# Altium project DM3370.PrjPcb (part 1 of 14)
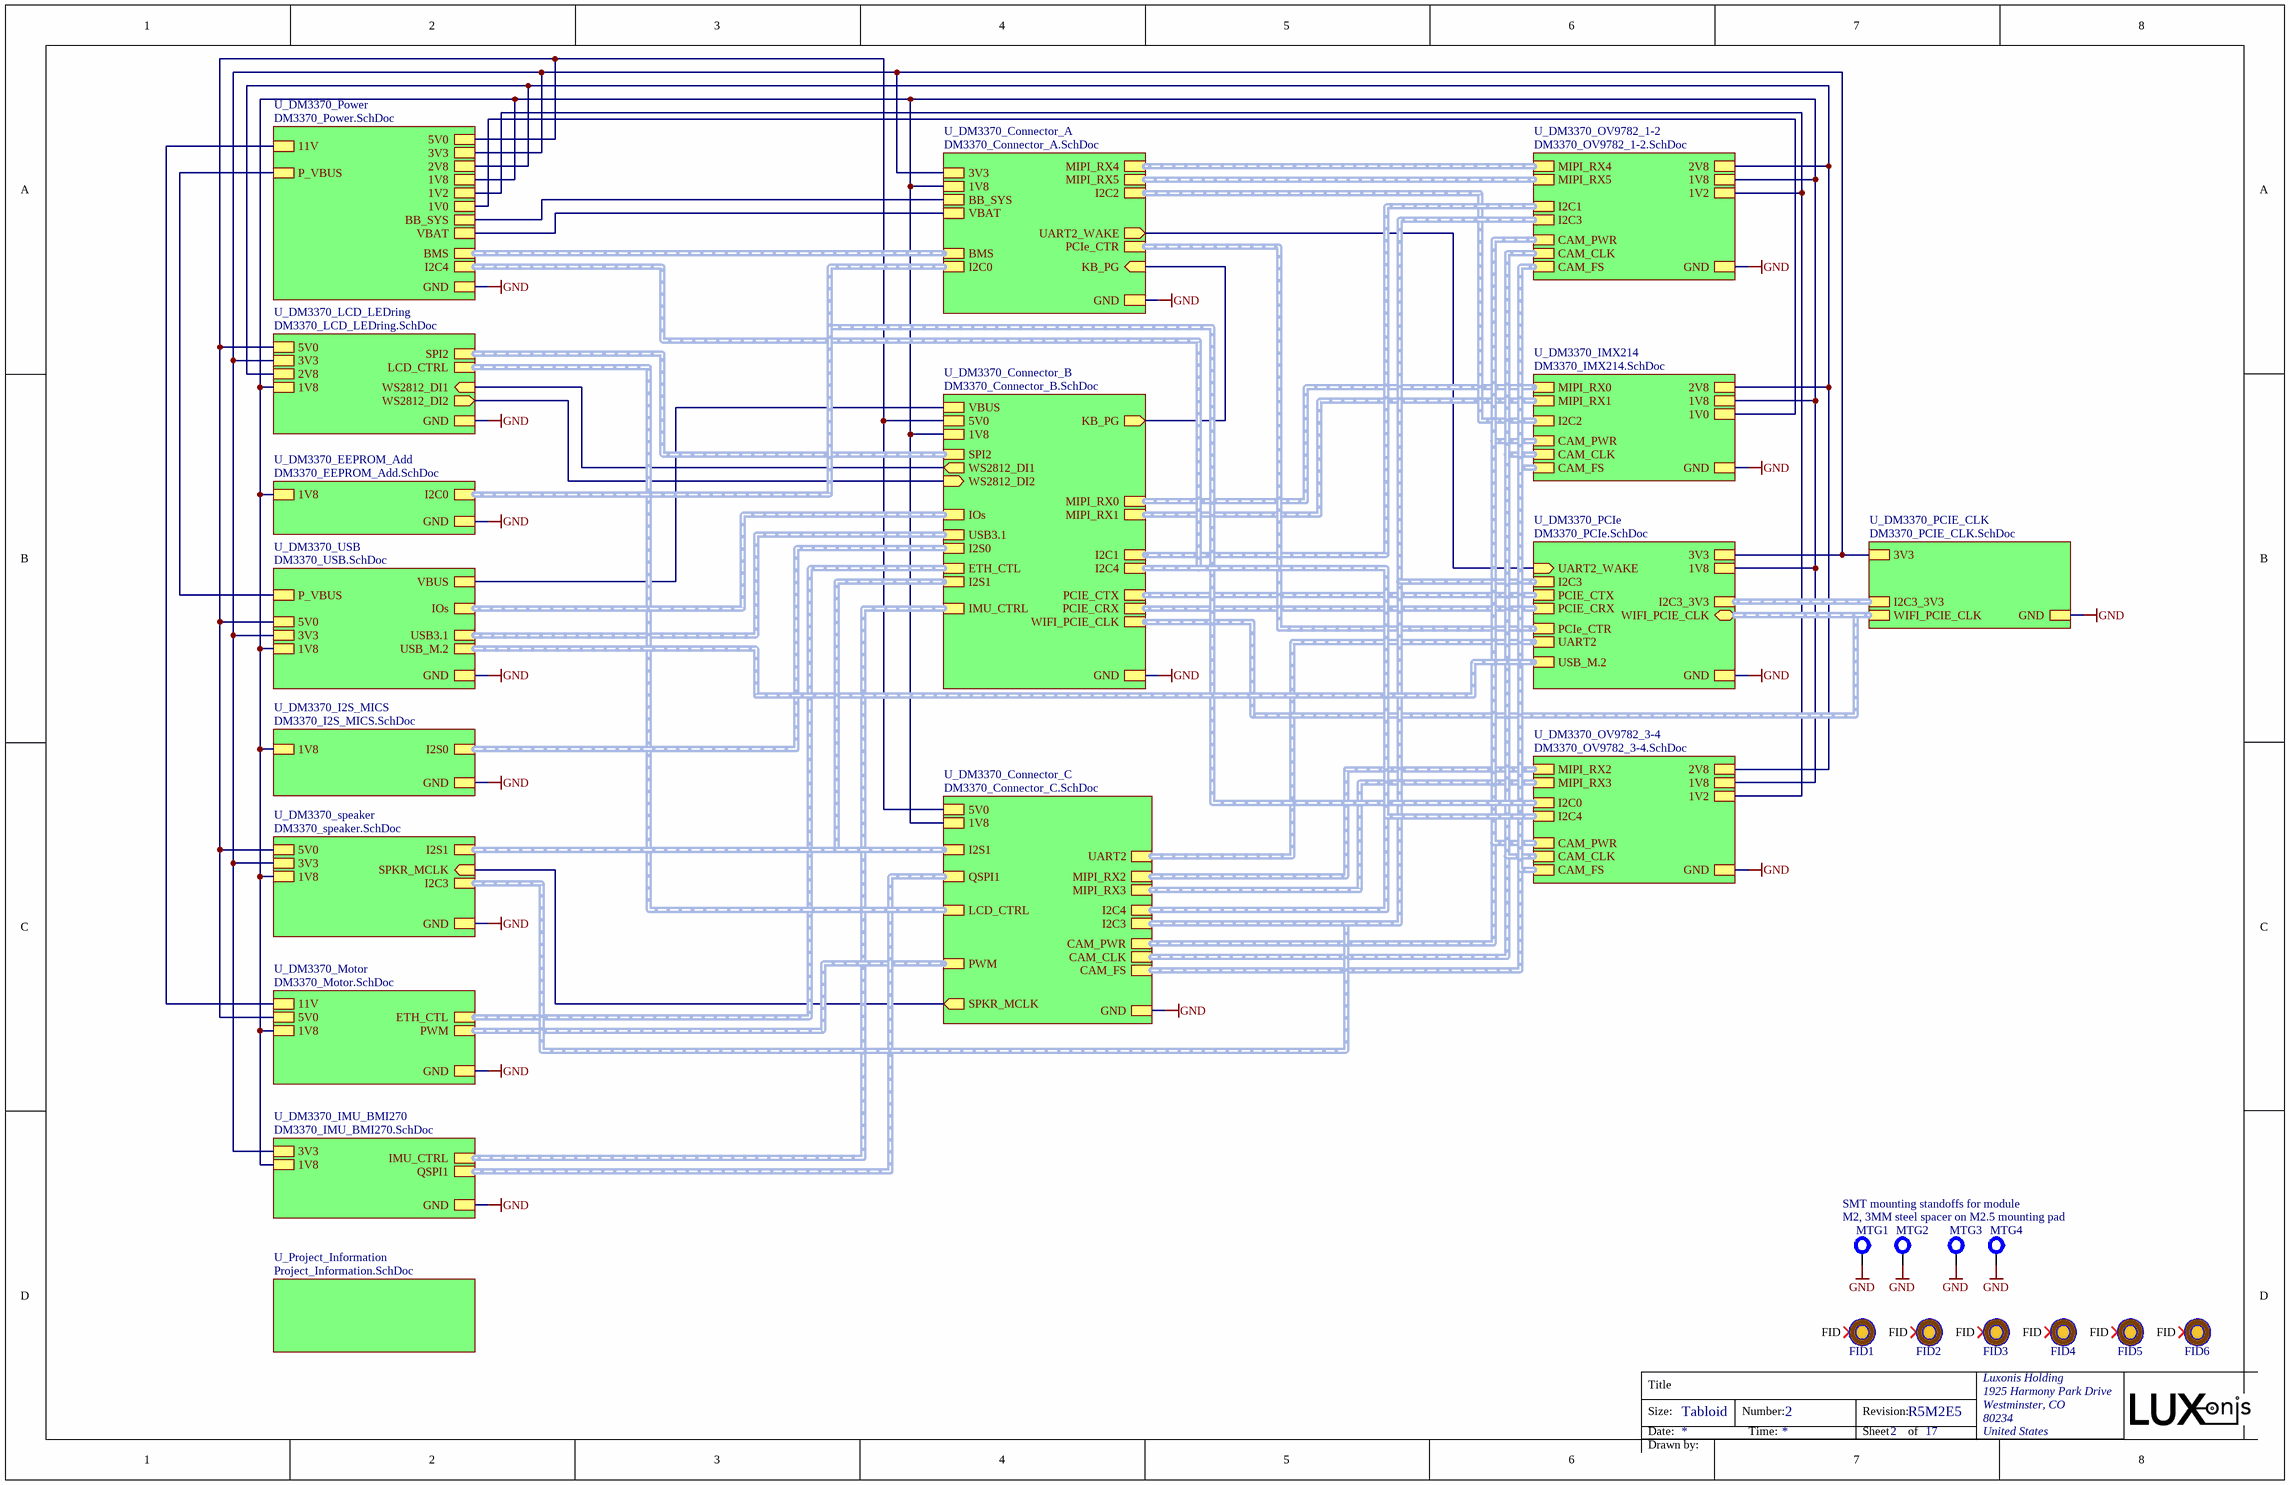
[diagram p0: TopLevel.SchDoc]
document_number: DXXXX; drawn_by: David Malovrh; project_title: DM3370; rev: R5M2E5; revision: R5M2E5
18 sheets, 540 parts. Net scope: hierarchical (ports join the sheet entries above them; power ports are global).
Board file: DM3370.PcbDoc
Sheets:
  TopLevel.SchDoc
    U_Project_Information = Project_Information.SchDoc
    U_DM3370_EEPROM_Add = DM3370_EEPROM_Add.SchDoc
    U_DM3370_Connector_A = DM3370_Connector_A.SchDoc
    U_DM3370_Connector_B = DM3370_Connector_B.SchDoc
    U_DM3370_Connector_C = DM3370_Connector_C.SchDoc
    U_DM3370_IMU_BMI270 = DM3370_IMU_BMI270.SchDoc
    U_DM3370_LCD_LEDring = DM3370_LCD_LEDring.SchDoc
    U_DM3370_Motor = DM3370_Motor.SchDoc
    U_DM3370_OV9782_1-2 = DM3370_OV9782_1-2.SchDoc
    U_DM3370_OV9782_3-4 = DM3370_OV9782_3-4.SchDoc
    U_DM3370_PCIe = DM3370_PCIe.SchDoc
    U_DM3370_IMX214 = DM3370_IMX214.SchDoc
    U_DM3370_Power = DM3370_Power.SchDoc
    U_DM3370_USB = DM3370_USB.SchDoc
    U_DM3370_PCIE_CLK = DM3370_PCIE_CLK.SchDoc
    U_DM3370_I2S_MICS = DM3370_I2S_MICS.SchDoc
    U_DM3370_speaker = DM3370_speaker.SchDoc

## Sheet TopLevel.SchDoc: =project_title
size Tabloid; PageSetup: Record=PageOptions|CenterHorizontal=True|CenterVertical=True|PrintScale=0.73|XCorrection=1.00|YCorrection=1.00|PrintKind=0|BorderSize=5000000|LeftOffset=0|BottomOffset=0|Orientation=2|PaperLength=1000|PaperWidth=1000|Scale=100|PaperSource=7|PrintQuality=-4|MediaType=1|DitherType=10|PaperKind=A4|PrintScaleMode=1; CompanyName: Luxonis Holding; DrawnBy: David Malovrh; Organization: Luxonis Holding; Address1: 1925 Harmony Park Drive; Address2: Westminster, CO; Address3: 80234; Address4: United States; DocumentNumber: 2; Revision: R5M2E5; SheetNumber: 2; SheetTotal: 17

### Parts
FID1  FIDUCIAL_ROUND_1MM  [FIDUCIAL_ROUND_1MM]  (value not drawn)  (no BOM)
FID2  FIDUCIAL_ROUND_1MM  [FIDUCIAL_ROUND_1MM]  (value not drawn)  (no BOM)
FID3  FIDUCIAL_ROUND_1MM  [FIDUCIAL_ROUND_1MM]  (value not drawn)  (no BOM)
FID4  FIDUCIAL_ROUND_1MM  [FIDUCIAL_ROUND_1MM]  (value not drawn)  (no BOM)
FID5  FIDUCIAL_ROUND_1MM  [FIDUCIAL_ROUND_1MM]  (value not drawn)  (no BOM)
FID6  FIDUCIAL_ROUND_1MM  [FIDUCIAL_ROUND_1MM]  (value not drawn)  (no BOM)
MTG1  M2, 3MM steel spacer on M2.5 mounting pad  [9774030243R]
MTG2  M2, 3MM steel spacer on M2.5 mounting pad  [9774030243R]  (value not drawn)
MTG3  M2, 3MM steel spacer on M2.5 mounting pad  [9774030243R]  (value not drawn)
MTG4  M2, 3MM steel spacer on M2.5 mounting pad  [9774030243R]  (value not drawn)

### Sub-sheets
U_DM3370_Connector_A = DM3370_Connector_A.SchDoc: GND, I2C2 (harness I2C2), MIPI_RX4 (harness MIPI_RX4), MIPI_RX5 (harness MIPI_RX5), I2C0 (harness I2C0), VBAT, KB_PG (in), PCIe_CTR (harness PCIe_CTR), UART2_WAKE (out), 1V8, 3V3, BMS, BB_SYS
U_DM3370_Connector_B = DM3370_Connector_B.SchDoc: GND, VBUS, I2C4 (harness I2C4), I2S0 (harness I2S0), USB3.1 (harness USB), ETH_CTL (harness ETH_PHY_CTL), MIPI_RX0 (harness MIPI_RX0), MIPI_RX1 (harness MIPI_RX1), I2C1 (harness I2C1), PCIE_CTX (harness PCIE_CTX), PCIE_CRX (harness PCIE_CRX), SPI2 (harness SPI2), IMU_CTRL (harness IMU_CTRL), 1V8, KB_PG (out), 5V0, WIFI_PCIE_CLK, WS2812_DI1 (out), WS2812_DI2 (in), IOs (harness USB), I2S1
U_DM3370_Connector_C = DM3370_Connector_C.SchDoc: GND, MIPI_RX2 (harness MIPI_RX2), MIPI_RX3 (harness MIPI_RX3), I2C3 (harness I2C3), QSPI1 (harness QSPI1), UART2 (harness UART2), I2C4 (harness I2C4), CAM_FS, CAM_CLK, CAM_PWR, 1V8, LCD_CTRL (harness USB_DRP_CTRL), SPKR_MCLK (out), PWM (harness KBIOs), 5V0, I2S1
U_DM3370_EEPROM_Add = DM3370_EEPROM_Add.SchDoc: 1V8, GND, I2C0 (harness I2C0)
U_DM3370_I2S_MICS = DM3370_I2S_MICS.SchDoc: 1V8, GND, I2S0 (harness I2S0)
U_DM3370_IMU_BMI270 = DM3370_IMU_BMI270.SchDoc: GND, 3V3, 1V8, IMU_CTRL (harness IMU_CTRL), QSPI1 (harness SPI0)
U_DM3370_IMX214 = DM3370_IMX214.SchDoc: I2C2 (harness I2C2), CAM_PWR (harness CAM_PWR), CAM_CLK (harness CAM_CLK), CAM_FS (harness CAM_FS), 2V8, 1V0, GND, 1V8, MIPI_RX0 (harness MIPI_RX0), MIPI_RX1 (harness MIPI_RX1)
U_DM3370_LCD_LEDring = DM3370_LCD_LEDring.SchDoc: 2V8, GND, 5V0, 1V8, SPI2 (harness SPI2), LCD_CTRL (harness LCD_CTRL), WS2812_DI1 (in), WS2812_DI2 (out), 3V3
U_DM3370_Motor = DM3370_Motor.SchDoc: 11V, GND, 1V8, ETH_CTL (harness ETH_PHY_CTL), PWM (harness KBIOs), 5V0
U_DM3370_OV9782_1-2 = DM3370_OV9782_1-2.SchDoc: 2V8, GND, I2C1 (harness I2C1), CAM_PWR (harness CAM_PWR), CAM_CLK (harness CAM_CLK), CAM_FS (harness CAM_FS), 1V2, 1V8, I2C3 (harness I2C3), MIPI_RX5 (harness MIPI_RX4), MIPI_RX4 (harness MIPI_RX4)
U_DM3370_OV9782_3-4 = DM3370_OV9782_3-4.SchDoc: 1V2, GND, CAM_PWR (harness CAM_PWR), CAM_CLK (harness CAM_CLK), CAM_FS (harness CAM_FS), 2V8, 1V8, I2C0 (harness I2C0), I2C4 (harness I2C4), MIPI_RX2 (harness MIPI_RX2), MIPI_RX3 (harness MIPI_RX3)
U_DM3370_PCIe = DM3370_PCIe.SchDoc: PCIE_CTX (harness PCIE_CTX), PCIE_CRX (harness PCIE_CRX), GND, 3V3, 1V8, PCIe_CTR (harness PCIe_CTR), UART2 (harness UART2), UART2_WAKE (in), WIFI_PCIE_CLK (bidir, harness WIFI_PCIE_CLK), I2C3_3V3 (harness I2C3_3V3), I2C3, USB_M.2
U_DM3370_PCIE_CLK = DM3370_PCIE_CLK.SchDoc: 3V3, GND, WIFI_PCIE_CLK (harness WIFI_PCIE_CLK), I2C3_3V3 (harness I2C3_3V3)
U_DM3370_Power = DM3370_Power.SchDoc: 11V, GND, 5V0, 3V3, 1V8, VBAT, P_VBUS, 1V2, 1V0, 2V8, I2C4 (harness I2C4), BMS (harness BMS), BB_SYS
U_DM3370_speaker = DM3370_speaker.SchDoc: 1V8, GND, I2S1 (harness I2S0), SPKR_MCLK (in), 3V3, 5V0, I2C3
U_DM3370_USB = DM3370_USB.SchDoc: VBUS, GND, 3V3, 5V0, 1V8, P_VBUS, USB3.1 (harness USB_KB), USB_M.2 (harness USB_MAX1), IOs
U_Project_Information = Project_Information.SchDoc: no entries

### Nets
1V0: sheet U_DM3370_IMX214/1V0, sheet U_DM3370_Power/1V0
1V2: sheet U_DM3370_OV9782_1-2/1V2, sheet U_DM3370_OV9782_3-4/1V2, sheet U_DM3370_Power/1V2
1V8: sheet U_DM3370_EEPROM_Add/1V8, sheet U_DM3370_Connector_A/1V8, sheet U_DM3370_Connector_B/1V8, sheet U_DM3370_Connector_C/1V8, sheet U_DM3370_IMU_BMI270/1V8, sheet U_DM3370_LCD_LEDring/1V8, sheet U_DM3370_Motor/1V8, sheet U_DM3370_OV9782_1-2/1V8, sheet U_DM3370_OV9782_3-4/1V8, sheet U_DM3370_PCIe/1V8, sheet U_DM3370_IMX214/1V8, sheet U_DM3370_Power/1V8, sheet U_DM3370_USB/1V8, sheet U_DM3370_I2S_MICS/1V8, sheet U_DM3370_speaker/1V8
2V8: sheet U_DM3370_LCD_LEDring/2V8, sheet U_DM3370_OV9782_1-2/2V8, sheet U_DM3370_OV9782_3-4/2V8, sheet U_DM3370_IMX214/2V8, sheet U_DM3370_Power/2V8
3V3: sheet U_DM3370_Connector_A/3V3, sheet U_DM3370_IMU_BMI270/3V3, sheet U_DM3370_LCD_LEDring/3V3, sheet U_DM3370_PCIe/3V3, sheet U_DM3370_Power/3V3, sheet U_DM3370_USB/3V3, sheet U_DM3370_PCIE_CLK/3V3, sheet U_DM3370_speaker/3V3
5V0: sheet U_DM3370_Connector_B/5V0, sheet U_DM3370_Connector_C/5V0, sheet U_DM3370_LCD_LEDring/5V0, sheet U_DM3370_Motor/5V0, sheet U_DM3370_Power/5V0, sheet U_DM3370_USB/5V0, sheet U_DM3370_speaker/5V0
11V: sheet U_DM3370_Motor/11V, sheet U_DM3370_Power/11V
BB_SYS: sheet U_DM3370_Connector_A/BB_SYS, sheet U_DM3370_Power/BB_SYS
GND: MTG1.1 MTG2.1 MTG3.1 MTG4.1 ; sheet U_DM3370_EEPROM_Add/GND, sheet U_DM3370_Connector_A/GND, sheet U_DM3370_Connector_B/GND, sheet U_DM3370_Connector_C/GND, sheet U_DM3370_IMU_BMI270/GND, sheet U_DM3370_LCD_LEDring/GND, sheet U_DM3370_Motor/GND, sheet U_DM3370_OV9782_1-2/GND, sheet U_DM3370_OV9782_3-4/GND, sheet U_DM3370_PCIe/GND, sheet U_DM3370_IMX214/GND, sheet U_DM3370_Power/GND, sheet U_DM3370_USB/GND, sheet U_DM3370_PCIE_CLK/GND, sheet U_DM3370_I2S_MICS/GND, sheet U_DM3370_speaker/GND
P_VBUS: sheet U_DM3370_Power/P_VBUS, sheet U_DM3370_USB/P_VBUS
VBAT: sheet U_DM3370_Connector_A/VBAT, sheet U_DM3370_Power/VBAT
VBUS: sheet U_DM3370_Connector_B/VBUS, sheet U_DM3370_USB/VBUS
KB_PG: sheet U_DM3370_Connector_A/KB_PG, sheet U_DM3370_Connector_B/KB_PG
MCLK: sheet U_DM3370_Connector_C/SPKR_MCLK, sheet U_DM3370_speaker/SPKR_MCLK
UART2_WAKE: sheet U_DM3370_Connector_A/UART2_WAKE, sheet U_DM3370_PCIe/UART2_WAKE
WS2812_DI: sheet U_DM3370_Connector_B/WS2812_DI1, sheet U_DM3370_LCD_LEDring/WS2812_DI1
WS2812_DO4: sheet U_DM3370_Connector_B/WS2812_DI2, sheet U_DM3370_LCD_LEDring/WS2812_DI2

Not connected (* = marked no-connect by the designer): FID1 FID*; FID2 FID*; FID3 FID*; FID4 FID*; FID5 FID*; FID6 FID*

### Buses and harness runs
harness sheet U_DM3370_Connector_A/BMS = sheet U_DM3370_Power/BMS
harness sheet U_DM3370_Connector_A/I2C0 = sheet U_DM3370_EEPROM_Add/I2C0 = sheet U_DM3370_OV9782_3-4/I2C0
harness sheet U_DM3370_Connector_A/I2C2 = sheet U_DM3370_IMX214/I2C2
harness sheet U_DM3370_Connector_A/MIPI_RX4 = sheet U_DM3370_OV9782_1-2/MIPI_RX4
harness sheet U_DM3370_Connector_A/MIPI_RX5 = sheet U_DM3370_OV9782_1-2/MIPI_RX5
harness sheet U_DM3370_Connector_A/PCIe_CTR = sheet U_DM3370_PCIe/PCIe_CTR
harness sheet U_DM3370_Connector_B/ETH_CTL = sheet U_DM3370_Motor/ETH_CTL
harness sheet U_DM3370_Connector_B/I2C1 = sheet U_DM3370_OV9782_1-2/I2C1
harness sheet U_DM3370_Connector_B/I2C4 = sheet U_DM3370_Connector_C/I2C4 = sheet U_DM3370_OV9782_3-4/I2C4 = sheet U_DM3370_Power/I2C4
harness sheet U_DM3370_Connector_B/I2S0 = sheet U_DM3370_I2S_MICS/I2S0
harness sheet U_DM3370_Connector_B/I2S1 = sheet U_DM3370_Connector_C/I2S1 = sheet U_DM3370_speaker/I2S1
harness sheet U_DM3370_Connector_B/IMU_CTRL = sheet U_DM3370_IMU_BMI270/IMU_CTRL
harness sheet U_DM3370_Connector_B/IOs = sheet U_DM3370_USB/IOs
harness sheet U_DM3370_Connector_B/MIPI_RX0 = sheet U_DM3370_IMX214/MIPI_RX0
harness sheet U_DM3370_Connector_B/MIPI_RX1 = sheet U_DM3370_IMX214/MIPI_RX1
harness sheet U_DM3370_Connector_B/PCIE_CRX = sheet U_DM3370_PCIe/PCIE_CRX
harness sheet U_DM3370_Connector_B/PCIE_CTX = sheet U_DM3370_PCIe/PCIE_CTX
harness sheet U_DM3370_Connector_B/SPI2 = sheet U_DM3370_LCD_LEDring/SPI2
harness sheet U_DM3370_Connector_B/USB3.1 = sheet U_DM3370_USB/USB3.1
harness sheet U_DM3370_Connector_B/WIFI_PCIE_CLK = sheet U_DM3370_PCIe/WIFI_PCIE_CLK = sheet U_DM3370_PCIE_CLK/WIFI_PCIE_CLK
harness sheet U_DM3370_Connector_C/CAM_CLK = sheet U_DM3370_IMX214/CAM_CLK = sheet U_DM3370_OV9782_1-2/CAM_CLK = sheet U_DM3370_OV9782_3-4/CAM_CLK
harness sheet U_DM3370_Connector_C/CAM_FS = sheet U_DM3370_IMX214/CAM_FS = sheet U_DM3370_OV9782_1-2/CAM_FS = sheet U_DM3370_OV9782_3-4/CAM_FS
harness sheet U_DM3370_Connector_C/CAM_PWR = sheet U_DM3370_IMX214/CAM_PWR = sheet U_DM3370_OV9782_1-2/CAM_PWR = sheet U_DM3370_OV9782_3-4/CAM_PWR
harness sheet U_DM3370_Connector_C/I2C3 = sheet U_DM3370_OV9782_1-2/I2C3 = sheet U_DM3370_PCIe/I2C3 = sheet U_DM3370_speaker/I2C3
harness sheet U_DM3370_Connector_C/LCD_CTRL = sheet U_DM3370_LCD_LEDring/LCD_CTRL
harness sheet U_DM3370_Connector_C/MIPI_RX2 = sheet U_DM3370_OV9782_3-4/MIPI_RX2
harness sheet U_DM3370_Connector_C/MIPI_RX3 = sheet U_DM3370_OV9782_3-4/MIPI_RX3
harness sheet U_DM3370_Connector_C/PWM = sheet U_DM3370_Motor/PWM
harness sheet U_DM3370_Connector_C/QSPI1 = sheet U_DM3370_IMU_BMI270/QSPI1
harness sheet U_DM3370_Connector_C/UART2 = sheet U_DM3370_PCIe/UART2
harness sheet U_DM3370_PCIe/I2C3_3V3 = sheet U_DM3370_PCIE_CLK/I2C3_3V3
harness sheet U_DM3370_PCIe/USB_M.2 = sheet U_DM3370_USB/USB_M.2

### Notes on the sheet
- SMT mounting standoffs for module
- Title
- Size:
- Date:
- Tabloid
- Number:
- Time:
- Revision:
- Sheet
- of
- Drawn by:

### Library data of the parts
FID1-FID6 = FIDUCIAL: Fiducial with various available footprints
MTG1-MTG4 = 9774030243R: MP ROUND STANDOFF M2X0.4 STEEL 3MM; Manufacturer 1: Wurth Electronics; Plating: Tin; Threaded/Unthreaded: Threaded; Outside Diameter: 0.171inch; Supplier 1: Digi-Key; Manufacturer Part Number 1: 9774030243R; Stock 1: 20568; Pricing 1: 1=0.95000, 10=0.91800, 50=0.79500, 100=0.73900 (USD); RoHS: Yes; Material: Steel; Length: 0.173inch; REACH SVHC: Unknown; ComponentLink1URL: http://www.mouser.com/ds/2/445/9774030243R-611455.pdf?src-supplier=Mouser; ComponentLink1Description: http://www.mouser.com/ds/2/445/9774030243R-611455.pdf?src-supplier=Mouser; ComponentLink2URL: http://www.farnell.com/datasheets/1960368.pdf?src-supplier=Farnell; ComponentLink2Description: http://www.farnell.com/datasheets/1960368.pdf?src-supplier=Farnell; ComponentLink3URL: https://katalog.we-online.de/em/datasheet/9774030243R.pdf?src-supplier=Digi-Key; ComponentLink3Description: https://katalog.we-online.de/em/datasheet/9774030243R.pdf?src-supplier=Digi-Key; ComponentLink4URL: http://www.farnell.com/datasheets/1960368.pdf?src-supplier=Newark; ComponentLink4Description: http://www.farnell.com/datasheets/1960368.pdf?src-supplier=Newark; ComponentLink5URL: http://www.farnell.com/datasheets/1960368.pdf?src-supplier=Element14; ComponentLink5Description: http://www.farnell.com/datasheets/1960368.pdf?src-supplier=Element14; Supplier Part Number 1: 732-7085-1-ND; Supplier 2: Mouser; Supplier Part Number 2: 710-9774030243R; Supplier 3: Element14; Supplier Part Number 3: 2497599

## Sheet Project_Information.SchDoc: =project_title
size Tabloid; CompanyName: Luxonis Holding; DrawnBy: David Malovrh; Organization: Luxonis Holding; Address1: 1925 Harmony Park Drive; Address2: Westminster, CO; Address3: 80234; Address4: United States; DocumentNumber: 1; SheetNumber: 1; SheetTotal: 17
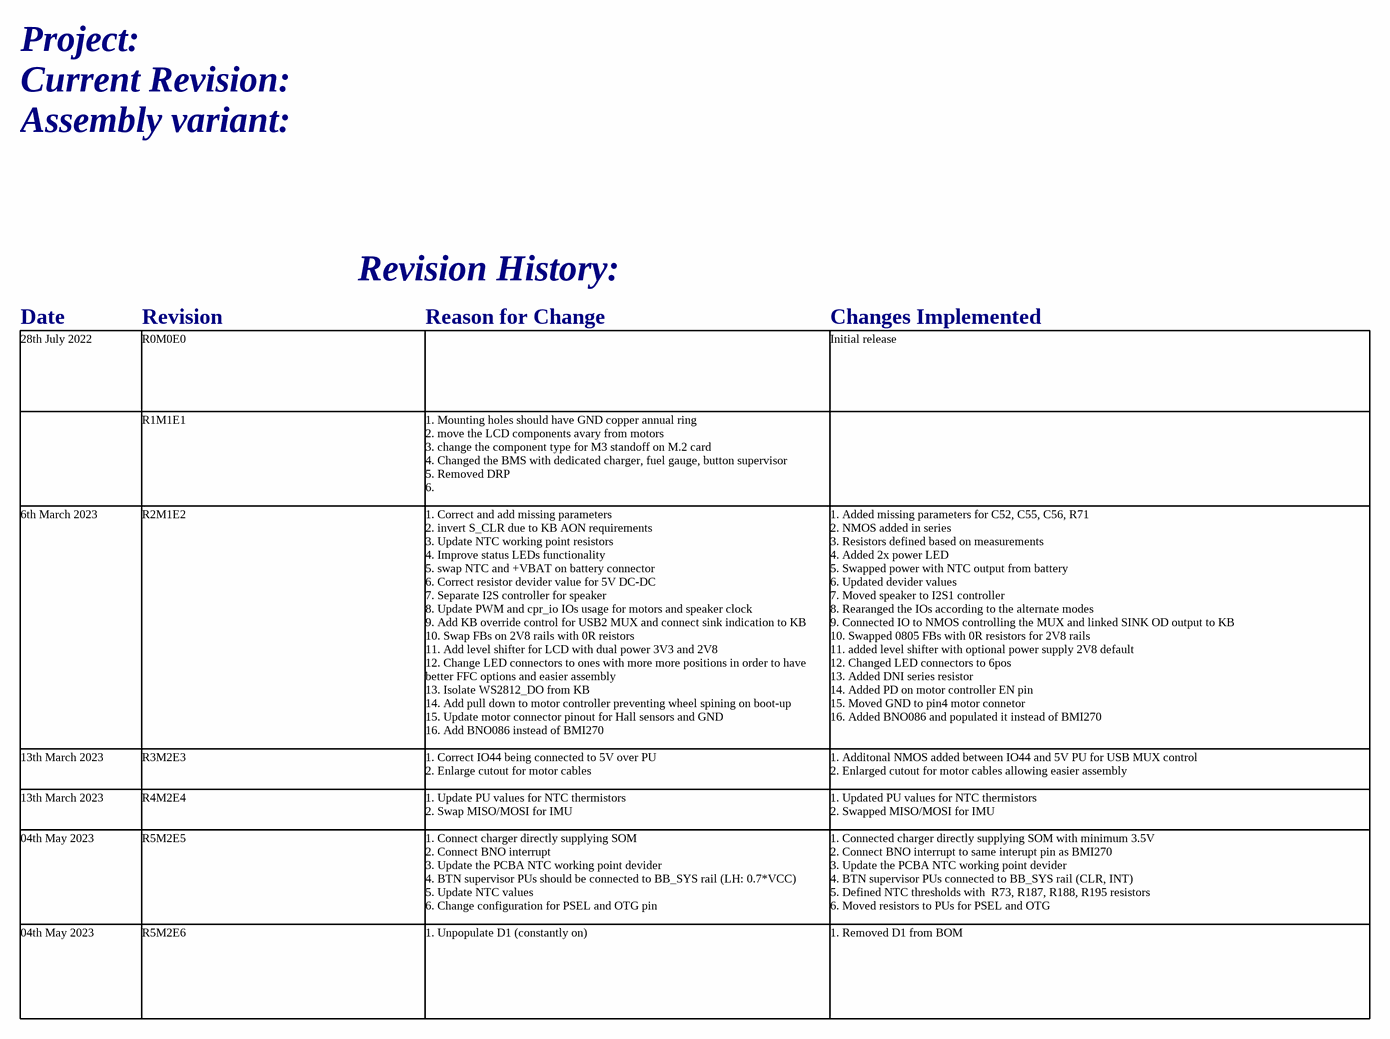
[diagram p1: Project_Information.SchDoc]

### Notes on the sheet
- Project:
- Current Revision:
- Assembly variant:
- Revision History:
- Date
- Revision
- Reason for Change
- Changes Implemented
- 28th July 2022
- R0M0E0
- Initial release
- R1M1E1
- 1. Mounting holes should have GND copper annual ring
  2. move the LCD components avary from motors
  3. change the component type for M3 standoff on M.2 card
  4. Changed the BMS with dedicated charger, fuel gauge, button supervisor
  5. Removed DRP
  6.
- 6th March 2023
- 13th March 2023
- R2M1E2
- R3M2E3
- 1. Correct and add missing parameters
  2. invert S_CLR due to KB AON requirements
  3. Update NTC working point resistors
  4. Improve status LEDs functionality
  5. swap NTC and +VBAT on battery connector
  6. Correct resistor devider value for 5V DC-DC
  7. Separate I2S controller for speaker
  8. Update PWM and cpr_io IOs usage for motors and speaker clock
  9. Add KB override control for USB2 MUX and connect sink indication to KB
  10. Swap FBs on 2V8 rails with 0R reistors
  11. Add level shifter for LCD with dual power 3V3 and 2V8
  12. Change LED connectors to ones with more more positions in order to have better FFC options and easier assembly
  13. Isolate WS2812_DO from KB
  14. Add pull down to motor controller preventing wheel spining on boot-up
  15. Update motor connector pinout for Hall sensors and GND
  16. Add BNO086 instead of BMI270
- 1. Correct IO44 being connected to 5V over PU
  2. Enlarge cutout for motor cables
- 1. Added missing parameters for C52, C55, C56, R71
  2. NMOS added in series
  3. Resistors defined based on measurements
  4. Added 2x power LED
  5. Swapped power with NTC output from battery
  6. Updated devider values
  7. Moved speaker to I2S1 controller
  8. Rearanged the IOs according to the alternate modes
  9. Connected IO to NMOS controlling the MUX and linked SINK OD output to KB
  10. Swapped 0805 FBs with 0R resistors for 2V8 rails
  11. added level shifter with optional power supply 2V8 default
  12. Changed LED connectors to 6pos
  13. Added DNI series resistor
  14. Added PD on motor controller EN pin
  15. Moved GND to pin4 motor connetor
  16. Added BNO086 and populated it instead of BMI270
- 1. Additonal NMOS added between IO44 and 5V PU for USB MUX control
  2. Enlarged cutout for motor cables allowing easier assembly
- R4M2E4
- 1. Update PU values for NTC thermistors
  2. Swap MISO/MOSI for IMU
- 1. Updated PU values for NTC thermistors
  2. Swapped MISO/MOSI for IMU
- 04th May 2023
- R5M2E5
- 1. Connect charger directly supplying SOM
  2. Connect BNO interrupt
  3. Update the PCBA NTC working point devider
  4. BTN supervisor PUs should be connected to BB_SYS rail (LH: 0.7*VCC)
  5. Update NTC values
  6. Change configuration for PSEL and OTG pin
- 1. Connected charger directly supplying SOM with minimum 3.5V
  2. Connect BNO interrupt to same interupt pin as BMI270
  3. Update the PCBA NTC working point devider
  4. BTN supervisor PUs connected to BB_SYS rail (CLR, INT)
  5. Defined NTC thresholds with  R73, R187, R188, R195 resistors
  6. Moved resistors to PUs for PSEL and OTG
- R5M2E6
- 1. Unpopulate D1 (constantly on)
- 1. Removed D1 from BOM
- Title
- Size:
- Date:
- Tabloid
- Number:
- Time:
- Revision:
- Sheet
- of
- Drawn by:

## Sheet DM3370_EEPROM_Add.SchDoc: =project_title
size Tabloid; PageSetup: Record=PageOptions|CenterHorizontal=True|CenterVertical=True|PrintScale=0.73|XCorrection=1.00|YCorrection=1.00|PrintKind=0|BorderSize=5000000|LeftOffset=0|BottomOffset=0|Orientation=2|PaperLength=1000|PaperWidth=1000|Scale=100|PaperSource=7|PrintQuality=-4|MediaType=1|DitherType=10|PaperKind=A4|PrintScaleMode=1; CompanyName: Luxonis Holding; DrawnBy: David Malovrh; Organization: Luxonis Holding; Address1: 1925 Harmony Park Drive; Address2: Westminster, CO; Address3: 80234; Address4: United States; DocumentNumber: 17; Revision: R5M2E5; SheetNumber: 17; SheetTotal: 17
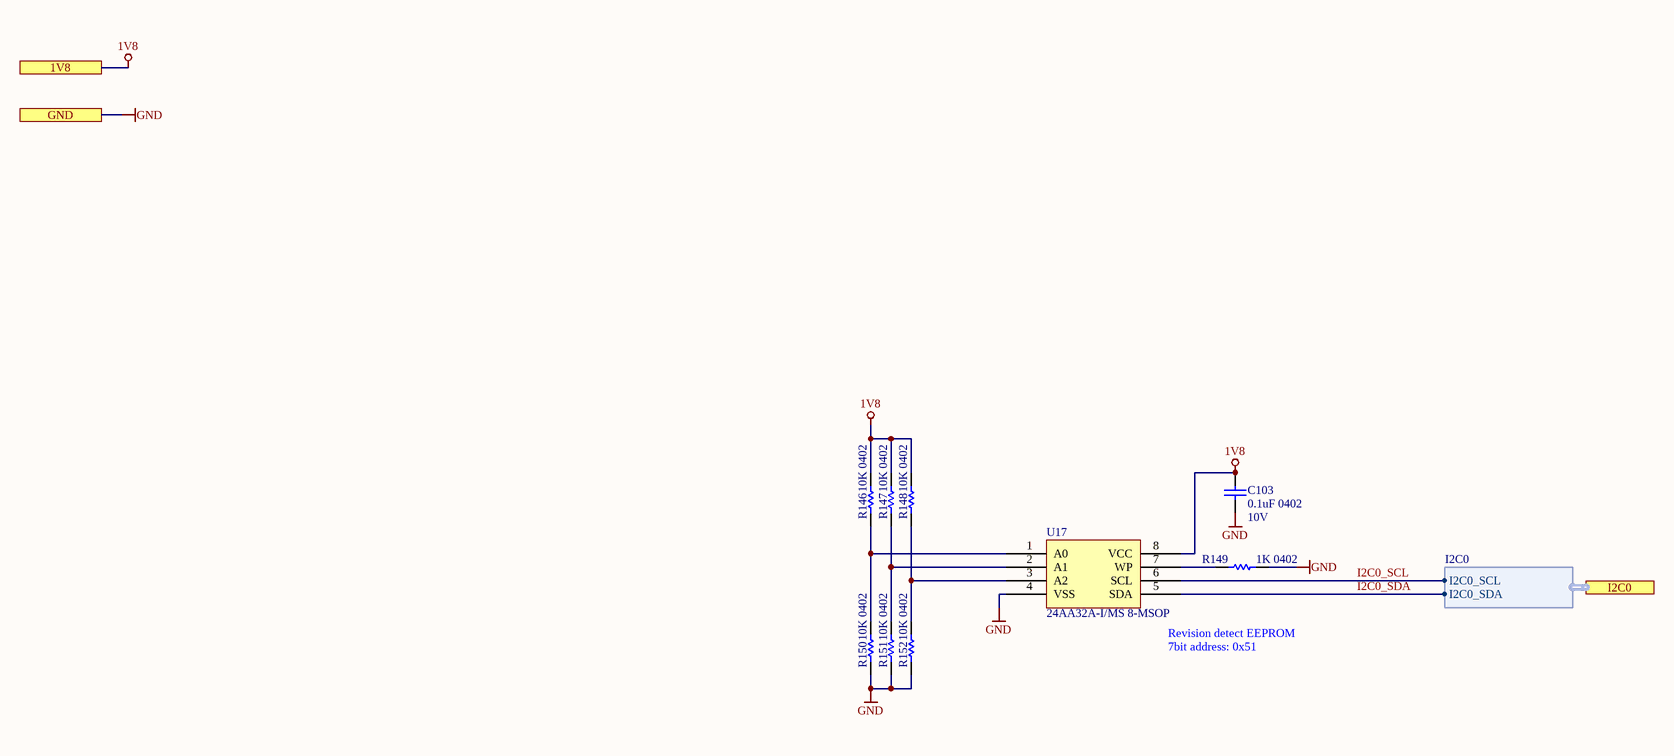
[diagram p2: DM3370_EEPROM_Add.SchDoc]

### Parts
C103  0.1uF 0402  Voltage Rating: 10V  [CAPC0402(1005)70_L]
R146  10K 0402  [RESC0402(1005)_L]
R147  10K 0402  [RESC0402(1005)_L]
R148  10K 0402  [RESC0402(1005)_L]
R149  1K 0402  [RESC0402(1005)_L]
R150  10K 0402  [RESC0402(1005)_L]
R151  10K 0402  [RESC0402(1005)_L]
R152  10K 0402  [RESC0402(1005)_L]
U17  24AA32A-I/MS 8-MSOP  [24AA32A-I/MS]

### Ports
1V8, GND, I2C0 (harness I2C0)

### Harnesses
I2C0: I2C0_SDA, I2C0_SCL

### Nets
1V8: C103.2 R146.2 R147.2 R148.2 U17.8(VCC) ; port 1V8
GND: C103.1 R149.1 R150.1 R151.1 R152.1 U17.4(VSS) ; port GND
I2C0_SCL: U17.6(SCL) ; port I2C0.I2C0_SCL
I2C0_SDA: U17.5(SDA) ; port I2C0.I2C0_SDA
NetR146_1: R146.1 R150.2 U17.1(A0)
NetR147_1: R147.1 R151.2 U17.2(A1)
NetR148_1: R148.1 R152.2 U17.3(A2)
NetR149_2: R149.2 U17.7(WP)

### Notes on the sheet
- (near U17) Revision detect EEPROM
- (near U17) 7bit address: 0x51
- Title
- Size:
- Date:
- Tabloid
- Number:
- Time:
- Revision:
- Sheet
- of
- Drawn by:

### Library data of the parts
C103 = GRM155R71A104JA01D: CAP CER 0.1UF 10V X7R 0402 5%; Manufacturer 1: Murata; Capacitance: 100nF; Supplier 1: Digi-Key; Manufacturer Part Number 1: GRM155R71A104JA01D; Stock 1: 1346709; Pricing 1: 1=0.10000, 10=0.02500, 100=0.01130, 500=0.00806, 1000=0.00633, 2500=0.00575, 5000=0.00529 (USD); RoHS: Yes; Mount: Surface Mount; Case/Package: 0402; Case Code (Imperial): 0402; Case Code (Metric): 1005; Min Operating Temperature: -55°C; Max Operating Temperature: 125°C; Tolerance: 5%; Packaging: Tape and Reel; Voltage Rating (DC): 10V; Dielectric: X7R; Package Quantity: 10000; Termination: SMD/SMT; Length: 1mm; Height: 0.5mm; Width: 0.02inch; Thickness: 0.022inch; Depth: 0.5mm; Radiation Hardening: No; Lead Free: Lead Free; ComponentLink1URL: https://datasheet.ciiva.com/5411/product-5411135.pdf?src-supplier=Mouser; ComponentLink1Description: https://datasheet.ciiva.com/5411/product-5411135.pdf?src-supplier=Mouser; ComponentLink2URL: https://datasheet.ciiva.com/11618/c02e-11618821.pdf?src-supplier=Avnet; ComponentLink2Description: https://datasheet.ciiva.com/11618/c02e-11618821.pdf?src-supplier=Avnet; Supplier Part Number 1: 490-10777-1-ND
R146-R148 R150-R152 = RC0402FR-1310KL: RES SMD 10K OHM 1% 0402 1/16W Chip Resistor, 0402 [1005 Metric], 10 kohm, RC Series, 50 V, Thick Film, 62.5 mW; Manufacturer 1: Yageo; Resistance: 10kR; Temperature Coefficient: 100ppm/°C; Power Rating: 62.5mW; Voltage Rating: 50V; ComponentLink1URL: https://datasheet.ciiva.com/16940/pyu-rc0402-51-rohs-l-6-16940293.pdf?src-supplier=Avnet+Europe; ComponentLink1Description: https://datasheet.ciiva.com/16940/pyu-rc0402-51-rohs-l-6-16940293.pdf?src-supplier=Avnet+Europe; ComponentLink2URL: https://datasheet.ciiva.com/28386/pyu-rc0402-51-rohs-l-6-28386855.pdf?src-supplier=Avnet+Europe; ComponentLink2Description: https://datasheet.ciiva.com/28386/pyu-rc0402-51-rohs-l-6-28386855.pdf?src-supplier=Avnet+Europe; ComponentLink3URL: https://datasheet.ciiva.com/16740/pyu-rc0402-51-rohs-l-6-r-16740602.pdf?src-supplier=Future+Electronics; ComponentLink3Description: https://datasheet.ciiva.com/16740/pyu-rc0402-51-rohs-l-6-r-16740602.pdf?src-supplier=Future+Electronics; ComponentLink4URL: https://datasheet.ciiva.com/8891/pyu-rc0402-51-rohs-l-6-8891339.pdf?src-supplier=Avnet; ComponentLink4Description: https://datasheet.ciiva.com/8891/pyu-rc0402-51-rohs-l-6-8891339.pdf?src-supplier=Avnet; ComponentLink5URL: https://datasheet.ciiva.com/5557/pyu-rc0402-51-rohs-l-6-r-5557997.pdf?src-supplier=Mouser; ComponentLink5Description: https://datasheet.ciiva.com/5557/pyu-rc0402-51-rohs-l-6-r-5557997.pdf?src-supplier=Mouser; ComponentLink6URL: https://datasheet.ciiva.com/7983/1018594-7983533.pdf?src-supplier=Element14; ComponentLink6Description: https://datasheet.ciiva.com/7983/1018594-7983533.pdf?src-supplier=Element14; Supplier 1: Newark; Manufacturer Part Number 1: RC0402FR-1310KL; Stock 1: 62239; Pricing 1: 1=0.10000, 25=0.01200, 100=0.00400, 250=0.00400, 500=0.00300, 1000=0.00300 (USD); RoHS: Yes; Case/Package: 0402; Number of Pins: 2; Contact Plating: Tin,Matte,Lead; Case Code (Imperial): 0402; Case Code (Metric): 1005; Min Operating Temperature: -55°C; Max Operating Temperature: 155°C; Tolerance: 1%; Composition: Thick Film; Packaging: Tape and Reel; Termination: SMD/SMT; Military Standard: Not; Voltage Rating (DC): 50V; Working Voltage: 50V; Number of Terminations: 2; Length: 1mm; Depth: 0.5mm; Radiation Hardening: No; REACH SVHC: No SVHC; Lead Free: Lead Free; Supplier Part Number 1: 67R9960; Supplier 2: Future Electronics; Supplier 3: Mouser; Supplier 4: Element14; Supplier Part Number 2: RC0402FR-1310KL-CUTT; Supplier Part Number 3: 603-RC0402FR-1310KL; Supplier Part Number 4: 1799235
R149 = RC0402FR-071KL: RES SMD 1K OHM 1% 1/16W 0402; Manufacturer 1: Yageo; Temperature Coefficient: 100ppm/°C; Power Rating: 62.5mW; Voltage Rating (DC): 50V; Resistance: 1kR; RoHS: Yes; Number of Pins: 2; Case Code (Imperial): 0402; Case Code (Metric): 1005; Min Operating Temperature: -55°C; Max Operating Temperature: 155°C; Packaging: Tape and Reel; Composition: Thick Film; Voltage Rating: 50V; Military Standard: Not; Termination: SMD/SMT; Length: 1mm; Height: 0.32mm; Width: 0.5mm; Depth: 0.5mm; Lead Free: Lead Free; REACH SVHC: Unknown; ComponentLink1URL: https://datasheet.ciiva.com/11819/0900766b80c66297-11819477.pdf?src-supplier=RSComponents; ComponentLink1Description: https://datasheet.ciiva.com/11819/0900766b80c66297-11819477.pdf?src-supplier=RSComponents; ComponentLink2URL: https://datasheet.ciiva.com/12666/pyu-rc0402-51-rohs-l-6-r-12666741.pdf?src-supplier=Mouser; ComponentLink2Description: https://datasheet.ciiva.com/12666/pyu-rc0402-51-rohs-l-6-r-12666741.pdf?src-supplier=Mouser; ComponentLink3URL: https://datasheet.ciiva.com/17063/pyu-rc0402-51-rohs-l-6-r-17063193.pdf?src-supplier=Future+Electronics; ComponentLink3Description: https://datasheet.ciiva.com/17063/pyu-rc0402-51-rohs-l-6-r-17063193.pdf?src-supplier=Future+Electronics; ComponentLink4URL: https://datasheet.ciiva.com/22747/1018594-22747513.pdf?src-supplier=Element14; ComponentLink4Description: https://datasheet.ciiva.com/22747/1018594-22747513.pdf?src-supplier=Element14; ComponentLink5URL: https://datasheet.ciiva.com/7849/1018594-7849869.pdf?src-supplier=Element14; ComponentLink5Description: https://datasheet.ciiva.com/7849/1018594-7849869.pdf?src-supplier=Element14; ComponentLink6URL: https://datasheet.ciiva.com/7983/1018594-7983502.pdf?src-supplier=Element14; ComponentLink6Description: https://datasheet.ciiva.com/7983/1018594-7983502.pdf?src-supplier=Element14; ComponentLink7URL: https://datasheet.ciiva.com/7849/1018594-7849871.pdf?src-supplier=Element14; ComponentLink7Description: https://datasheet.ciiva.com/7849/1018594-7849871.pdf?src-supplier=Element14; Supplier 1: Digi-Key; Manufacturer Part Number 1: RC0402FR-071KL; Stock 1: 60695854; Pricing 1: 1=0.10000, 10=0.01600, 100=0.00670, 1000=0.00301, 2500=0.00261, 5000=0.00215 (USD); Case/Package: 0402; Tolerance: 1%; Supplier Part Number 1: 311-1.00KLRCT-ND
U17 = 24AA32A-I/MS: IC EEPROM 32K I2C 400KHZ 8MSOP Memory IC 32Kb (4K x 8) I²C 400kHz 900ns 8-MSOP; Manufacturer 1: Microchip; Interface: I2C,Serial,2-Wire; Access Time: 3500ns; Max Supply Voltage: 5.5V; Min Supply Voltage: 1.7V; Nominal Supply Current: 3mA; Supplier 1: Digi-Key; Stock 1: 4213; Pricing 1: 1=0.39000, 25=0.38120, 100=0.36050 (USD); RoHS: Yes; Mount: Surface Mount; Case/Package: MSOP; Number of Pins: 8; Contact Plating: Tin,Matte; Min Operating Temperature: -40°C; Max Operating Temperature: 85°C; Max Frequency: 400kHz; Frequency: 400kHz; Packaging: Rail/Tube; Density: 32Kb; Memory Size: 32Kb; Package Quantity: 100; Length: 3mm; Height: 0.85mm; Width: 3mm; Radiation Hardening: No; Lead Free: Lead Free; REACH SVHC: No SVHC; ComponentLink1URL: https://datasheet.ciiva.com/16309/filehandler-aspxddocname-en011853-16309808.pdf?src-supplier=Future+Electronics; ComponentLink1Description: https://datasheet.ciiva.com/16309/filehandler-aspxddocname-en011853-16309808.pdf?src-supplier=Future+Electronics; ComponentLink2URL: https://datasheet.ciiva.com/16621/21713l-16621382.pdf?src-supplier=Avnet+Europe; ComponentLink2Description: https://datasheet.ciiva.com/16621/21713l-16621382.pdf?src-supplier=Avnet+Europe; ComponentLink3URL: https://datasheet.ciiva.com/3185/21713l-3185209.pdf?src-supplier=Avnet; ComponentLink3Description: https://datasheet.ciiva.com/3185/21713l-3185209.pdf?src-supplier=Avnet; ComponentLink4URL: https://datasheet.ciiva.com/1154/1688094-1154810.pdf?src-supplier=Element14; ComponentLink4Description: https://datasheet.ciiva.com/1154/1688094-1154810.pdf?src-supplier=Element14; ComponentLink5URL: https://datasheet.ciiva.com/41454/001085239-da-01-en-ic-eeprom-32kbit-24aa32a-i-ms-msop-8-mcp-41454934.pdf?src-supplier=Conrad; ComponentLink5Description: https://datasheet.ciiva.com/41454/001085239-da-01-en-ic-eeprom-32kbit-24aa32a-i-ms-msop-8-mcp-41454934.pdf?src-supplier=Conrad; Supplier Part Number 1: 24AA32A-I/MS-ND; Memory Type: EEPROM; Manufacturer Part Number 1: 24AA32A-I/MS; Supplier 2: Mouser; Supplier 3: Newark; Supplier Part Number 2: 579-24AA32A-I/MS; Supplier Part Number 3: 38AH9658

## Sheet DM3370_Connector_A.SchDoc: =project_title
size Tabloid; CompanyName: Luxonis Holding; DrawnBy: David Malovrh; Organization: Luxonis Holding; Address1: 1925 Harmony Park Drive; Address2: Westminster, CO; Address3: 80234; Address4: United States; DocumentNumber: 4; SheetNumber: 4; SheetTotal: 17
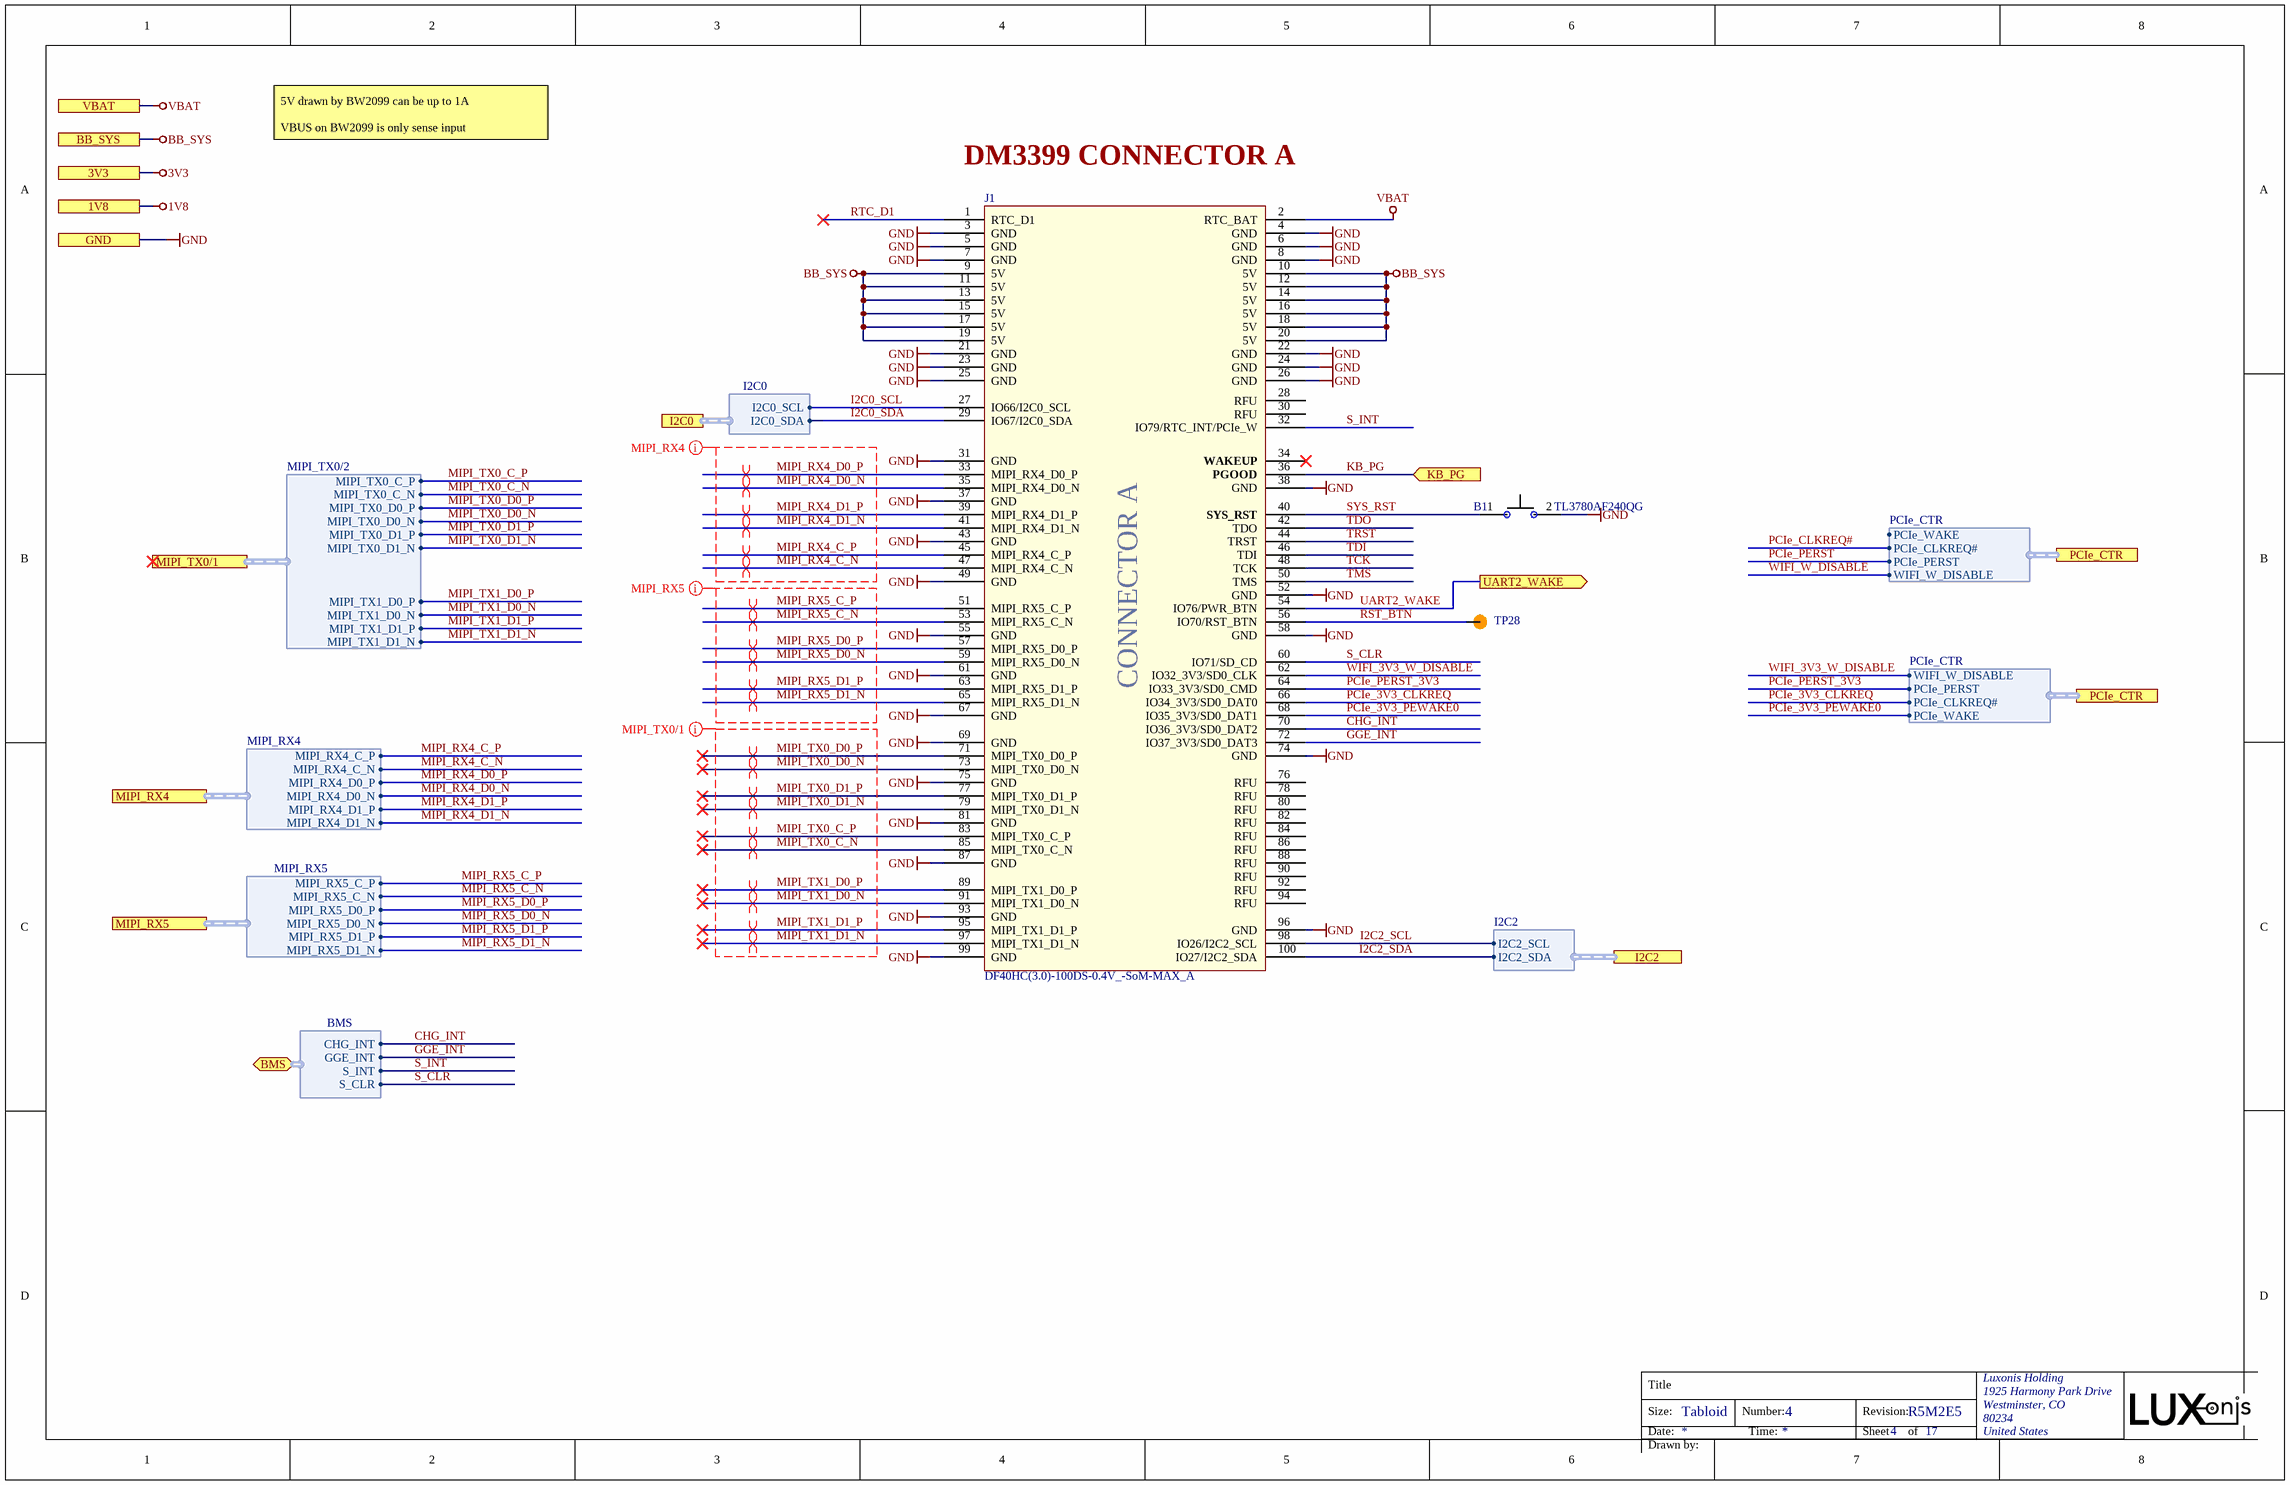
[diagram p3: DM3370_Connector_A.SchDoc]

### Parts
B1  TL3780AF240QG  [TL3780AF240QG-Footprint-1]
J1  DF40HC(3.0)-100DS-0.4V_-SoM-MAX_A  [SOM_MAX_CONN_A_DF40HC-3.0-100DS-0.4V_minpad]
TP28  TEST_POINT  [TP075_150_NS]  (value not drawn)  (no BOM)

### Ports
1V8, 3V3, BB_SYS, BMS (bidir, harness BMS), GND, I2C0 (harness I2C0), I2C2 (harness I2C2), KB_PG (in), MIPI_RX4 (harness MIPI_RX4), MIPI_RX5 (harness MIPI_RX5), MIPI_TX0/1 (harness MIPI_TX0/2), PCIe_CTR (harness PCIe_CTR), UART2_WAKE (out), VBAT

### Harnesses
I2C2: I2C2_SDA, I2C2_SCL
MIPI_RX4: MIPI_RX4_C_P, MIPI_RX4_C_N, MIPI_RX4_D0_P, MIPI_RX4_D0_N, MIPI_RX4_D1_P, MIPI_RX4_D1_N
MIPI_RX5: MIPI_RX5_C_P, MIPI_RX5_C_N, MIPI_RX5_D0_P, MIPI_RX5_D0_N, MIPI_RX5_D1_P, MIPI_RX5_D1_N
MIPI_TX0/2: MIPI_TX0_C_P, MIPI_TX0_C_N, MIPI_TX0_D0_P, MIPI_TX0_D0_N, MIPI_TX0_D1_P, MIPI_TX0_D1_N, MIPI_TX1_D0_P, MIPI_TX1_D0_N, MIPI_TX1_D1_P, MIPI_TX1_D1_N
I2C0: I2C0_SDA, I2C0_SCL
PCIe_CTR: PCIe_CLKREQ#, PCIe_PERST, PCIe_WAKE, WIFI_W_DISABLE
BMS: CHG_INT, GGE_INT, S_INT, S_CLR

### Nets
BB_SYS: J1.9(5V) J1.10(5V) J1.11(5V) J1.12(5V) J1.13(5V) J1.14(5V) J1.15(5V) J1.16(5V) J1.17(5V) J1.18(5V) J1.19(5V) J1.20(5V) ; port BB_SYS
GND: B1.2 J1.3(GND) J1.4(GND) J1.5(GND) J1.6(GND) J1.7(GND) J1.8(GND) J1.21(GND) J1.22(GND) J1.23(GND) J1.24(GND) J1.25(GND) J1.26(GND) J1.31(GND) J1.37(GND) J1.38(GND) J1.43(GND) J1.49(GND) J1.52(GND) J1.55(GND) J1.58(GND) J1.61(GND) J1.67(GND) J1.69(GND) J1.74(GND) J1.75(GND) J1.81(GND) J1.87(GND) J1.93(GND) J1.96(GND) J1.99(GND) ; port GND
VBAT: J1.2(RTC_BAT) ; port VBAT
CHG_INT: J1.70(IO36_3V3/SD0_DAT2) ; port BMS.CHG_INT
GGE_INT: J1.72(IO37_3V3/SD0_DAT3) ; port BMS.GGE_INT
I2C0_SCL: J1.27(IO66/I2C0_SCL) ; port I2C0.I2C0_SCL
I2C0_SDA: J1.29(IO67/I2C0_SDA) ; port I2C0.I2C0_SDA
I2C2_SCL: J1.98(IO26/I2C2_SCL) ; port I2C2.I2C2_SCL
I2C2_SDA: J1.100(IO27/I2C2_SDA) ; port I2C2.I2C2_SDA
KB_PG: J1.36(PGOOD) ; port KB_PG
MIPI_RX4_C_N: J1.47(MIPI_RX4_C_N) ; port MIPI_RX4.MIPI_RX4_C_N
MIPI_RX4_C_P: J1.45(MIPI_RX4_C_P) ; port MIPI_RX4.MIPI_RX4_C_P
MIPI_RX4_D0_N: J1.35(MIPI_RX4_D0_N) ; port MIPI_RX4.MIPI_RX4_D0_N
MIPI_RX4_D0_P: J1.33(MIPI_RX4_D0_P) ; port MIPI_RX4.MIPI_RX4_D0_P
MIPI_RX4_D1_N: J1.41(MIPI_RX4_D1_N) ; port MIPI_RX4.MIPI_RX4_D1_N
MIPI_RX4_D1_P: J1.39(MIPI_RX4_D1_P) ; port MIPI_RX4.MIPI_RX4_D1_P
MIPI_RX5_C_N: J1.53(MIPI_RX5_C_N) ; port MIPI_RX5.MIPI_RX5_C_N
MIPI_RX5_C_P: J1.51(MIPI_RX5_C_P) ; port MIPI_RX5.MIPI_RX5_C_P
MIPI_RX5_D0_N: J1.59(MIPI_RX5_D0_N) ; port MIPI_RX5.MIPI_RX5_D0_N
MIPI_RX5_D0_P: J1.57(MIPI_RX5_D0_P) ; port MIPI_RX5.MIPI_RX5_D0_P
MIPI_RX5_D1_N: J1.65(MIPI_RX5_D1_N) ; port MIPI_RX5.MIPI_RX5_D1_N
MIPI_RX5_D1_P: J1.63(MIPI_RX5_D1_P) ; port MIPI_RX5.MIPI_RX5_D1_P
MIPI_TX0_C_N: J1.85(MIPI_TX0_C_N) ; port MIPI_TX0/1.MIPI_TX0_C_N
MIPI_TX0_C_P: J1.83(MIPI_TX0_C_P) ; port MIPI_TX0/1.MIPI_TX0_C_P
MIPI_TX0_D0_N: J1.73(MIPI_TX0_D0_N) ; port MIPI_TX0/1.MIPI_TX0_D0_N
MIPI_TX0_D0_P: J1.71(MIPI_TX0_D0_P) ; port MIPI_TX0/1.MIPI_TX0_D0_P
MIPI_TX0_D1_N: J1.79(MIPI_TX0_D1_N) ; port MIPI_TX0/1.MIPI_TX0_D1_N
MIPI_TX0_D1_P: J1.77(MIPI_TX0_D1_P) ; port MIPI_TX0/1.MIPI_TX0_D1_P
MIPI_TX1_D0_N: J1.91(MIPI_TX1_D0_N) ; port MIPI_TX0/1.MIPI_TX1_D0_N
MIPI_TX1_D0_P: J1.89(MIPI_TX1_D0_P) ; port MIPI_TX0/1.MIPI_TX1_D0_P
MIPI_TX1_D1_N: J1.97(MIPI_TX1_D1_N) ; port MIPI_TX0/1.MIPI_TX1_D1_N
MIPI_TX1_D1_P: J1.95(MIPI_TX1_D1_P) ; port MIPI_TX0/1.MIPI_TX1_D1_P
PCIe_3V3_CLKREQ: J1.66(IO34_3V3/SD0_DAT0) ; port PCIe_CTR.PCIe_CLKREQ#  [also labelled PCIe_CLKREQ#]
PCIe_3V3_PEWAKE0: J1.68(IO35_3V3/SD0_DAT1) ; port PCIe_CTR.PCIe_WAKE
PCIe_PERST: J1.64(IO33_3V3/SD0_CMD) ; port PCIe_CTR.PCIe_PERST  [also labelled PCIe_PERST_3V3]  [project net PCIe_3V3_PERST]
RST_BTN: J1.56(IO70/RST_BTN) TP28.1
RTC_D1: J1.1(RTC_D1)
S_CLR: J1.60(IO71/SD_CD) ; port BMS.S_CLR
S_INT: J1.32(IO79/RTC_INT/PCIe_W) ; port BMS.S_INT
SYS_RST: B1.1 J1.40(SYS_RST)
TCK: J1.48(TCK)
TDI: J1.46(TDI)
TDO: J1.42(TDO)
TMS: J1.50(TMS)
TRST: J1.44(TRST)
UART2_WAKE: J1.54(IO76/PWR_BTN) ; port UART2_WAKE
WIFI_3V3_W_DISABLE: J1.62(IO32_3V3/SD0_CLK) ; port PCIe_CTR.WIFI_W_DISABLE  [also labelled WIFI_W_DISABLE]

Not connected (* = marked no-connect by the designer): J1 28(RFU) 30(RFU) 34(WAKEUP)* 76(RFU) 78(RFU) 80(RFU) 82(RFU) 84(RFU) 86(RFU) 88(RFU) 90(RFU) 92(RFU) 94(RFU)

### Layout directives
differential pair; differential pair class 100ohm: MIPI_RX4_C_N, MIPI_RX4_C_P, MIPI_RX4_D0_N, MIPI_RX4_D0_P, MIPI_RX4_D1_N, MIPI_RX4_D1_P, MIPI_RX5_C_N, MIPI_RX5_C_P, MIPI_RX5_D0_N, MIPI_RX5_D0_P, MIPI_RX5_D1_N, MIPI_RX5_D1_P, MIPI_TX0_C_N, MIPI_TX0_C_P, MIPI_TX0_D0_N, MIPI_TX0_D0_P, MIPI_TX0_D1_N, MIPI_TX0_D1_P, MIPI_TX1_D0_N, MIPI_TX1_D0_P, MIPI_TX1_D1_N, MIPI_TX1_D1_P
net class MIPI_RX4: MIPI_RX4_C_N, MIPI_RX4_C_P, MIPI_RX4_D0_N, MIPI_RX4_D0_P, MIPI_RX4_D1_N, MIPI_RX4_D1_P
net class MIPI_TX0/1: MIPI_TX0_C_N, MIPI_TX0_C_P, MIPI_TX0_D0_N, MIPI_TX0_D0_P, MIPI_TX0_D1_N, MIPI_TX0_D1_P, MIPI_TX1_D0_N, MIPI_TX1_D0_P, MIPI_TX1_D1_N, MIPI_TX1_D1_P
net class MIPI_RX5: MIPI_RX5_C_N, MIPI_RX5_C_P, MIPI_RX5_D0_N, MIPI_RX5_D0_P, MIPI_RX5_D1_N, MIPI_RX5_D1_P

### Notes on the sheet
- 5V drawn by BW2099 can be up to 1A
  VBUS on BW2099 is only sense input
- (near J1) DM3399 CONNECTOR A
- Title
- Size:
- Date:
- Tabloid
- Number:
- Time:
- Revision:
- Sheet
- of
- Drawn by:
- (in symbol CMP-040-000000-5) CONNECTOR A

### Library data of the parts
B1 = CMP-011-00023-1: Keypad Switch, 1 Switches, SPST, Momentary-tactile, 0.05A, 12VDC, 2.35N, Solder Terminal, Surface Mount-straight; Manufacturer 1: E-Switch; Manufacturer Part Number 1: TL3780AF240QG
J1 = CMP-040-000000-5: OAK-SoM-MAX base board conn. A; Manufacturer 1: Hirose; Manufacturer Part Number 1: DF40HC(3.0)-100DS-0.4V(58); Pitch: 0.016inch; System: Connector; Connector Type: Receptacle; Number of Positions: 100; Lead Free: Lead Free; Design Item ID: DF40HC(3.0)-100DS-0.4V_-SoM-MAX_A; Source: LuxonisMaster_nejc.SchLib; Pricing 2: 1=2.50000, 10=2.40000, 25=2.10000, 50=2.10000, 100=2.00000, 250=1.76000, 500=1.71000, 1000=1.45000, 2000=1.36000, 5000=1.31000, 10000=1.31000 (USD); RoHS: Yes; Mount: Surface Mount; ComponentLink1Description: https://datasheet.ciiva.com/46636/ed-df40-20140305-46636517.pdf?src-supplier=Digi-Key; Contact Plating: Gold; ComponentLink1URL: https://datasheet.ciiva.com/46636/ed-df40-20140305-46636517.pdf?src-supplier=Digi-Key; ComponentLink4Description: https://datasheet.ciiva.com/18562/ed-df40-20140305-18562462.pdf?src-supplier=Digi-Key; Stock 2: 2078; ComponentLink4URL: https://datasheet.ciiva.com/18562/ed-df40-20140305-18562462.pdf?src-supplier=Digi-Key; Packaging: Tape and Reel; Package Quantity: 1000; ComponentLink3Description: https://datasheet.ciiva.com/13559/ed-df40-20140305-13559540.pdf?src-supplier=Mouser; Pricing 1: 1=2.54000, 10=2.26000, 25=2.07000, 50=2.07000, 100=1.98000, 250=1.79000, 500=1.65000, 1000=1.41000, 3000=1.32000, 6000=1.23000, 10000=1.23000 (USD); Stock 1: 2172; ComponentLink2Description: https://datasheet.ciiva.com/18562/ed-df40-20140305-18562189.pdf?src-supplier=Digi-Key; Number of Rows: 2; ComponentLink3URL: https://datasheet.ciiva.com/13559/ed-df40-20140305-13559540.pdf?src-supplier=Mouser; ComponentLink2URL: https://datasheet.ciiva.com/18562/ed-df40-20140305-18562189.pdf?src-supplier=Digi-Key
TP28 = CMP-015-000000-1: Design Item ID: TEST_POINT; Source: LuxonisMaster.SchLib